# Vivado block design bram_lutwave, xczu28dr-ffvg1517-2-e, Vivado 2021.1
# (continued, part 3 of 5)
current_bd_instance /mix_chan2

create_bd_cell -type ip -vlnv xilinx.com:ip:xlslice:1.0 I0
set_property -dict {CONFIG.DIN_FROM 15 CONFIG.DIN_WIDTH 64 CONFIG.DOUT_WIDTH 16} [get_bd_cells I0]
create_bd_cell -type ip -vlnv xilinx.com:ip:xlslice:1.0 Q0
set_property -dict {CONFIG.DIN_FROM 31 CONFIG.DIN_TO 16 CONFIG.DIN_WIDTH 64 CONFIG.DOUT_WIDTH 16} [get_bd_cells Q0]
create_bd_cell -type ip -vlnv xilinx.com:ip:xlslice:1.0 I1
set_property -dict {CONFIG.DIN_FROM 47 CONFIG.DIN_TO 32 CONFIG.DIN_WIDTH 64 CONFIG.DOUT_WIDTH 16} [get_bd_cells I1]
create_bd_cell -type ip -vlnv xilinx.com:ip:xlslice:1.0 Q1
set_property -dict {CONFIG.DIN_FROM 63 CONFIG.DIN_TO 48 CONFIG.DIN_WIDTH 64 CONFIG.DOUT_WIDTH 16} [get_bd_cells Q1]
create_bd_cell -type ip -vlnv xilinx.com:ip:xlconcat:2.1 xlconcat_0
set_property -dict [list \
  CONFIG.IN0_WIDTH 16 \
  CONFIG.IN1_WIDTH 16 \
  CONFIG.IN2_WIDTH 16 \
  CONFIG.IN3_WIDTH 16 \
  CONFIG.NUM_PORTS 4 \
] [get_bd_cells xlconcat_0]
create_bd_cell -type ip -vlnv xilinx.com:ip:xlslice:1.0 adc_q0
set_property -dict {CONFIG.DIN_FROM 15 CONFIG.DOUT_WIDTH 16} [get_bd_cells adc_q0]
create_bd_cell -type ip -vlnv xilinx.com:ip:xlconstant:1.1 xlconstant_1
create_bd_cell -type ip -vlnv xilinx.com:ip:xlslice:1.0 adc_q1
set_property -dict {CONFIG.DIN_FROM 31 CONFIG.DIN_TO 16 CONFIG.DOUT_WIDTH 16} [get_bd_cells adc_q1]
create_bd_cell -type ip -vlnv xilinx.com:ip:xlconcat:2.1 iin
set_property -dict {CONFIG.IN0_WIDTH 16 CONFIG.IN1_WIDTH 16} [get_bd_cells iin]
create_bd_cell -type ip -vlnv xilinx.com:ip:xlslice:1.0 adc_i0
set_property -dict {CONFIG.DIN_FROM 15 CONFIG.DOUT_WIDTH 16} [get_bd_cells adc_i0]
create_bd_cell -type ip -vlnv xilinx.com:ip:xlslice:1.0 adc_i1
set_property -dict {CONFIG.DIN_FROM 31 CONFIG.DIN_TO 16 CONFIG.DOUT_WIDTH 16} [get_bd_cells adc_i1]
create_bd_cell -type ip -vlnv xilinx.com:ip:xlconcat:2.1 qin
set_property -dict {CONFIG.IN0_WIDTH 16 CONFIG.IN1_WIDTH 16} [get_bd_cells qin]
create_bd_cell -type ip -vlnv User_Company:SysGen:cordic_mix_v1:1.0 cordic_mix_v1_adc
create_bd_cell -type ip -vlnv User_Company:SysGen:cordic_mix_v1:1.0 cordic_mix_v1_dac

# ---- hierarchy /mix_chan3 ----
current_bd_instance /mix_chan3
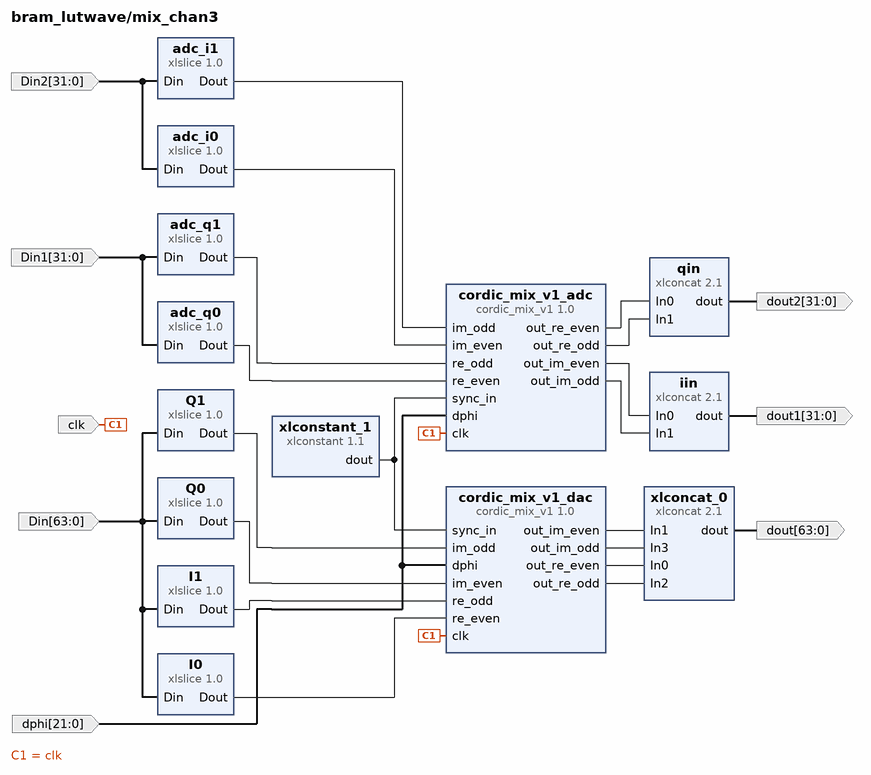
[diagram p36: block diagram inside /mix_chan3]
create_bd_pin -dir I -from 63 -to 0 Din
create_bd_pin -dir I -from 21 -to 0 -type data dphi
create_bd_pin -dir I -type clk clk
create_bd_pin -dir O -from 63 -to 0 dout
create_bd_pin -dir I -from 31 -to 0 Din1
create_bd_pin -dir O -from 31 -to 0 dout1
create_bd_pin -dir I -from 31 -to 0 Din2
create_bd_pin -dir O -from 31 -to 0 dout2

create_bd_cell -type ip -vlnv xilinx.com:ip:xlslice:1.0 I0
set_property -dict {CONFIG.DIN_FROM 15 CONFIG.DIN_WIDTH 64 CONFIG.DOUT_WIDTH 16} [get_bd_cells I0]
create_bd_cell -type ip -vlnv xilinx.com:ip:xlslice:1.0 Q0
set_property -dict {CONFIG.DIN_FROM 31 CONFIG.DIN_TO 16 CONFIG.DIN_WIDTH 64 CONFIG.DOUT_WIDTH 16} [get_bd_cells Q0]
create_bd_cell -type ip -vlnv xilinx.com:ip:xlslice:1.0 I1
set_property -dict {CONFIG.DIN_FROM 47 CONFIG.DIN_TO 32 CONFIG.DIN_WIDTH 64 CONFIG.DOUT_WIDTH 16} [get_bd_cells I1]
create_bd_cell -type ip -vlnv xilinx.com:ip:xlslice:1.0 Q1
set_property -dict {CONFIG.DIN_FROM 63 CONFIG.DIN_TO 48 CONFIG.DIN_WIDTH 64 CONFIG.DOUT_WIDTH 16} [get_bd_cells Q1]
create_bd_cell -type ip -vlnv xilinx.com:ip:xlconcat:2.1 xlconcat_0
set_property -dict [list \
  CONFIG.IN0_WIDTH 16 \
  CONFIG.IN1_WIDTH 16 \
  CONFIG.IN2_WIDTH 16 \
  CONFIG.IN3_WIDTH 16 \
  CONFIG.NUM_PORTS 4 \
] [get_bd_cells xlconcat_0]
create_bd_cell -type ip -vlnv xilinx.com:ip:xlslice:1.0 adc_q0
set_property -dict {CONFIG.DIN_FROM 15 CONFIG.DOUT_WIDTH 16} [get_bd_cells adc_q0]
create_bd_cell -type ip -vlnv xilinx.com:ip:xlconstant:1.1 xlconstant_1
create_bd_cell -type ip -vlnv xilinx.com:ip:xlslice:1.0 adc_q1
set_property -dict {CONFIG.DIN_FROM 31 CONFIG.DIN_TO 16 CONFIG.DOUT_WIDTH 16} [get_bd_cells adc_q1]
create_bd_cell -type ip -vlnv xilinx.com:ip:xlconcat:2.1 iin
set_property -dict {CONFIG.IN0_WIDTH 16 CONFIG.IN1_WIDTH 16} [get_bd_cells iin]
create_bd_cell -type ip -vlnv xilinx.com:ip:xlslice:1.0 adc_i0
set_property -dict {CONFIG.DIN_FROM 15 CONFIG.DOUT_WIDTH 16} [get_bd_cells adc_i0]
create_bd_cell -type ip -vlnv xilinx.com:ip:xlslice:1.0 adc_i1
set_property -dict {CONFIG.DIN_FROM 31 CONFIG.DIN_TO 16 CONFIG.DOUT_WIDTH 16} [get_bd_cells adc_i1]
create_bd_cell -type ip -vlnv xilinx.com:ip:xlconcat:2.1 qin
set_property -dict {CONFIG.IN0_WIDTH 16 CONFIG.IN1_WIDTH 16} [get_bd_cells qin]
create_bd_cell -type ip -vlnv User_Company:SysGen:cordic_mix_v1:1.0 cordic_mix_v1_adc
create_bd_cell -type ip -vlnv User_Company:SysGen:cordic_mix_v1:1.0 cordic_mix_v1_dac

# ---- hierarchy /mix_chan4 ----
current_bd_instance /mix_chan4
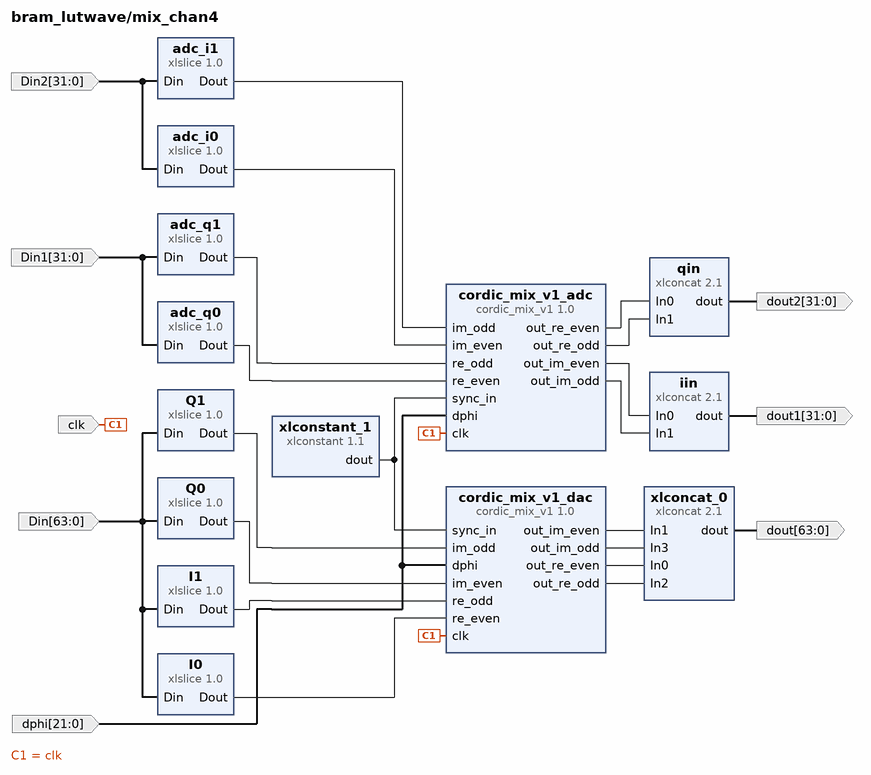
[diagram p37: block diagram inside /mix_chan4]
create_bd_pin -dir I -from 63 -to 0 Din
create_bd_pin -dir I -from 21 -to 0 -type data dphi
create_bd_pin -dir I -type clk clk
create_bd_pin -dir O -from 63 -to 0 dout
create_bd_pin -dir I -from 31 -to 0 Din1
create_bd_pin -dir O -from 31 -to 0 dout1
create_bd_pin -dir I -from 31 -to 0 Din2
create_bd_pin -dir O -from 31 -to 0 dout2

create_bd_cell -type ip -vlnv xilinx.com:ip:xlslice:1.0 I0
set_property -dict {CONFIG.DIN_FROM 15 CONFIG.DIN_WIDTH 64 CONFIG.DOUT_WIDTH 16} [get_bd_cells I0]
create_bd_cell -type ip -vlnv xilinx.com:ip:xlslice:1.0 Q0
set_property -dict {CONFIG.DIN_FROM 31 CONFIG.DIN_TO 16 CONFIG.DIN_WIDTH 64 CONFIG.DOUT_WIDTH 16} [get_bd_cells Q0]
create_bd_cell -type ip -vlnv xilinx.com:ip:xlslice:1.0 I1
set_property -dict {CONFIG.DIN_FROM 47 CONFIG.DIN_TO 32 CONFIG.DIN_WIDTH 64 CONFIG.DOUT_WIDTH 16} [get_bd_cells I1]
create_bd_cell -type ip -vlnv xilinx.com:ip:xlslice:1.0 Q1
set_property -dict {CONFIG.DIN_FROM 63 CONFIG.DIN_TO 48 CONFIG.DIN_WIDTH 64 CONFIG.DOUT_WIDTH 16} [get_bd_cells Q1]
create_bd_cell -type ip -vlnv xilinx.com:ip:xlconcat:2.1 xlconcat_0
set_property -dict [list \
  CONFIG.IN0_WIDTH 16 \
  CONFIG.IN1_WIDTH 16 \
  CONFIG.IN2_WIDTH 16 \
  CONFIG.IN3_WIDTH 16 \
  CONFIG.NUM_PORTS 4 \
] [get_bd_cells xlconcat_0]
create_bd_cell -type ip -vlnv xilinx.com:ip:xlslice:1.0 adc_q0
set_property -dict {CONFIG.DIN_FROM 15 CONFIG.DOUT_WIDTH 16} [get_bd_cells adc_q0]
create_bd_cell -type ip -vlnv xilinx.com:ip:xlconstant:1.1 xlconstant_1
create_bd_cell -type ip -vlnv xilinx.com:ip:xlslice:1.0 adc_q1
set_property -dict {CONFIG.DIN_FROM 31 CONFIG.DIN_TO 16 CONFIG.DOUT_WIDTH 16} [get_bd_cells adc_q1]
create_bd_cell -type ip -vlnv xilinx.com:ip:xlconcat:2.1 iin
set_property -dict {CONFIG.IN0_WIDTH 16 CONFIG.IN1_WIDTH 16} [get_bd_cells iin]
create_bd_cell -type ip -vlnv xilinx.com:ip:xlslice:1.0 adc_i0
set_property -dict {CONFIG.DIN_FROM 15 CONFIG.DOUT_WIDTH 16} [get_bd_cells adc_i0]
create_bd_cell -type ip -vlnv xilinx.com:ip:xlslice:1.0 adc_i1
set_property -dict {CONFIG.DIN_FROM 31 CONFIG.DIN_TO 16 CONFIG.DOUT_WIDTH 16} [get_bd_cells adc_i1]
create_bd_cell -type ip -vlnv xilinx.com:ip:xlconcat:2.1 qin
set_property -dict {CONFIG.IN0_WIDTH 16 CONFIG.IN1_WIDTH 16} [get_bd_cells qin]
create_bd_cell -type ip -vlnv User_Company:SysGen:cordic_mix_v1:1.0 cordic_mix_v1_adc
create_bd_cell -type ip -vlnv User_Company:SysGen:cordic_mix_v1:1.0 cordic_mix_v1_dac

# ---- connections ----

current_bd_instance /chan1
connect_bd_intf_net [get_bd_intf_pins S_AXI2] [get_bd_intf_pins axi_dphi_bram/S_AXI]
connect_bd_intf_net [get_bd_intf_pins axi_dphi_bram/BRAM_PORTA] [get_bd_intf_pins blk_mem_gen_0/BRAM_PORTA]
connect_bd_intf_net [get_bd_intf_pins S_AXI1] [get_bd_intf_pins wide_bram/S_AXI]
connect_bd_intf_net [get_bd_intf_pins S00_AXI] [get_bd_intf_pins dsp_regs_0/S00_AXI]
connect_bd_intf_net [get_bd_intf_pins S_AXI] [get_bd_intf_pins axi_wide_ctrl/S_AXI]
connect_bd_net -net Din_2 [get_bd_pins dsp_regs_0/reg2out] [get_bd_pins accum_sync/Din]
connect_bd_net -net In1_1 [get_bd_pins In1] [get_bd_pins wide_bram/In1] [get_bd_pins i_adc_splitter/Din]
connect_bd_net [get_bd_pins blk_mem_gen_0/doutb] [get_bd_pins even_bin_slice/Din] [get_bd_pins odd_bin_slice/Din]
connect_bd_net -net Q_concat_dout [get_bd_pins fft_concat/dout] [get_bd_pins wide_bram/In2]
connect_bd_net [get_bd_pins accum_concat/dout] [get_bd_pins c_shift_ram_0/D]
connect_bd_net -net axi_gpio_0_gpio2_io_o [get_bd_pins axi_wide_ctrl/gpio2_io_o] [get_bd_pins xlslice_1/Din] [get_bd_pins xlslice_2/Din]
connect_bd_net -net axi_gpio_0_gpio_io_o [get_bd_pins axi_wide_ctrl/gpio_io_o] [get_bd_pins wide_bram/max_count_minus_one_step]
connect_bd_net [get_bd_pins blast_module_v6_cord_0/accum_snap_i0] [get_bd_pins accum_concat/In0]
connect_bd_net [get_bd_pins blast_module_v6_cord_0/accum_snap_i1] [get_bd_pins accum_concat/In2]
connect_bd_net [get_bd_pins blast_module_v6_cord_0/accum_snap_q0] [get_bd_pins accum_concat/In1]
connect_bd_net [get_bd_pins blast_module_v6_cord_0/accum_snap_q1] [get_bd_pins accum_concat/In3]
connect_bd_net [get_bd_pins blast_module_v6_cord_0/accum_snap_sync] [get_bd_pins wide_bram/d4] [get_bd_pins accum_snap_sync]
connect_bd_net [get_bd_pins blast_module_v6_cord_0/ddc_snap_i0q0] [get_bd_pins ddc_concat/In0]
connect_bd_net [get_bd_pins blast_module_v6_cord_0/ddc_snap_i1q1] [get_bd_pins ddc_concat/In1]
connect_bd_net [get_bd_pins blast_module_v6_cord_0/ddc_snap_sync] [get_bd_pins wide_bram/d2]
connect_bd_net [get_bd_pins blast_module_v6_cord_0/fft_snap_i0q0] [get_bd_pins fft_concat/In0]
connect_bd_net [get_bd_pins blast_module_v6_cord_0/fft_snap_i1q1] [get_bd_pins fft_concat/In1]
connect_bd_net [get_bd_pins blast_module_v6_cord_0/fft_snap_sync] [get_bd_pins wide_bram/d1]
connect_bd_net [get_bd_pins c_counter_binary_0/Q] [get_bd_pins blk_mem_gen_0/addrb]
connect_bd_net [get_bd_pins c_shift_ram_0/Q] [get_bd_pins wide_bram/d3] [get_bd_pins Q]
connect_bd_net -net clk_wiz_0_clk_out1 [get_bd_pins s00_axi_aclk] \
  [get_bd_pins dsp_regs_0/s00_axi_aclk] [get_bd_pins wide_bram/s_axi_aclk] [get_bd_pins wide_bram/CLK] \
  [get_bd_pins c_counter_binary_0/CLK] [get_bd_pins blk_mem_gen_0/clkb] [get_bd_pins c_shift_ram_0/CLK] \
  [get_bd_pins axi_dphi_bram/s_axi_aclk] [get_bd_pins blast_module_v6_cord_0/clk]
connect_bd_net -net delay_2_q [get_bd_pins In0] [get_bd_pins wide_bram/In0] [get_bd_pins q_adc_splitter/Din]
connect_bd_net -net dina_1 [get_bd_pins ddc_concat/dout] [get_bd_pins wide_bram/In3]
connect_bd_net [get_bd_pins dsp_regs_0/reg0out] [get_bd_pins fft_shift_slice/Din] [get_bd_pins load_bins_slice/Din]
connect_bd_net [get_bd_pins dsp_regs_0/reg1out] [get_bd_pins bin_num_slice/Din]
connect_bd_net [get_bd_pins dsp_regs_0/reg3out] [get_bd_pins dds_shift_slice/Din]
connect_bd_net [get_bd_pins even_bin_slice/Dout] [get_bd_pins blast_module_v6_cord_0/dphi_even]
connect_bd_net -net gpio1_Dout [get_bd_pins fft_shift_slice/Dout] [get_bd_pins blast_module_v6_cord_0/fft_shift]
connect_bd_net -net gpio1_Dout1 [get_bd_pins load_bins_slice/Dout] [get_bd_pins blast_module_v6_cord_0/load_bins]
connect_bd_net -net i0_Dout [get_bd_pins dds_shift_slice/Dout] [get_bd_pins blast_module_v6_cord_0/dds_shift]
connect_bd_net -net i2_Dout [get_bd_pins bin_num_slice/Dout] [get_bd_pins blast_module_v6_cord_0/bin_num]
connect_bd_net -net i_splitter_i0 [get_bd_pins i_adc_splitter/i0] [get_bd_pins blast_module_v6_cord_0/adc_i0]
connect_bd_net -net i_splitter_i1 [get_bd_pins i_adc_splitter/i1] [get_bd_pins blast_module_v6_cord_0/adc_i1]
connect_bd_net -net module_config_splitter_Dout [get_bd_pins accum_sync/sync_in] \
  [get_bd_pins c_counter_binary_0/CE] [get_bd_pins blk_mem_gen_0/enb] [get_bd_pins blast_module_v6_cord_0/start_dac]
connect_bd_net -net module_config_splitter_accum_len [get_bd_pins accum_sync/accum_len] [get_bd_pins blast_module_v6_cord_0/accum_len]
connect_bd_net -net module_config_splitter_i1 [get_bd_pins accum_sync/accum_rst] [get_bd_pins blast_module_v6_cord_0/accum_reset]
connect_bd_net [get_bd_pins odd_bin_slice/Dout] [get_bd_pins blast_module_v6_cord_0/dphi_odd]
connect_bd_net -net q_splitter_i0 [get_bd_pins q_adc_splitter/i0] [get_bd_pins blast_module_v6_cord_0/adc_q0]
connect_bd_net -net q_splitter_i1 [get_bd_pins q_adc_splitter/i1] [get_bd_pins blast_module_v6_cord_0/adc_q1]
connect_bd_net -net rst_ps8_0_99M1_peripheral_aresetn [get_bd_pins s_axi_aresetn1] \
  [get_bd_pins wide_bram/s_axi_aresetn] [get_bd_pins dsp_regs_0/s00_axi_aresetn] [get_bd_pins axi_dphi_bram/s_axi_aresetn]
connect_bd_net -net rst_ps8_0_99M_peripheral_aresetn [get_bd_pins s_axi_aresetn] [get_bd_pins axi_wide_ctrl/s_axi_aresetn]
connect_bd_net [get_bd_pins xlconstant_5/dout] [get_bd_pins blk_mem_gen_0/web]
connect_bd_net [get_bd_pins xlconstant_6/dout] [get_bd_pins blk_mem_gen_0/rstb]
connect_bd_net [get_bd_pins xlconstant_7/dout] [get_bd_pins blk_mem_gen_0/dinb]
connect_bd_net [get_bd_pins xlslice_1/Dout] [get_bd_pins wide_bram/rising_edge_start]
connect_bd_net [get_bd_pins xlslice_2/Dout] [get_bd_pins wide_bram/sel]
connect_bd_net -net zynq_ultra_ps_e_0_pl_clk0 [get_bd_pins s_axi_aclk] [get_bd_pins axi_wide_ctrl/s_axi_aclk]

current_bd_instance /chan1/q_adc_splitter
connect_bd_net [get_bd_pins i0/Dout] [get_bd_pins i0]
connect_bd_net [get_bd_pins i1/Dout] [get_bd_pins i1]
connect_bd_net -net usp_rf_data_converter_0_m02_axis_tdata [get_bd_pins Din] [get_bd_pins i0/Din] [get_bd_pins i1/Din]

current_bd_instance /chan1/accum_sync
connect_bd_net -net i0_Dout [get_bd_pins accum_len/Dout] [get_bd_pins accum_len]
connect_bd_net -net i1_Dout [get_bd_pins accum_rst/Dout] [get_bd_pins accum_rst]
connect_bd_net -net i2_Dout [get_bd_pins sync_in/Dout] [get_bd_pins sync_in]
connect_bd_net -net usp_rf_data_converter_0_m02_axis_tdata [get_bd_pins Din] \
  [get_bd_pins accum_len/Din] [get_bd_pins accum_rst/Din] [get_bd_pins sync_in/Din]

current_bd_instance /chan1/i_adc_splitter
connect_bd_net [get_bd_pins i0/Dout] [get_bd_pins i0]
connect_bd_net [get_bd_pins i1/Dout] [get_bd_pins i1]
connect_bd_net -net usp_rf_data_converter_0_m02_axis_tdata [get_bd_pins Din] [get_bd_pins i0/Din] [get_bd_pins i1/Din]

current_bd_instance /chan1/wide_bram
connect_bd_intf_net [get_bd_intf_pins axi_bram_ctrl_0/BRAM_PORTA] [get_bd_intf_pins blk_mem_gen_0/BRAM_PORTA]
connect_bd_intf_net [get_bd_intf_pins S_AXI] [get_bd_intf_pins axi_bram_ctrl_0/S_AXI]
connect_bd_net -net In0_1 [get_bd_pins In0] [get_bd_pins adc_concat/In0]
connect_bd_net -net In1_1 [get_bd_pins In1] [get_bd_pins adc_concat/In1]
connect_bd_net -net In2_1 [get_bd_pins In2] [get_bd_pins pfb_concat/In0]
connect_bd_net -net In3_1 [get_bd_pins In3] [get_bd_pins ddc_concat/In0]
connect_bd_net [get_bd_pins axi_bram_mealy_x16_w_0/address] [get_bd_pins blk_mem_gen_0/addrb]
connect_bd_net [get_bd_pins axi_bram_mealy_x16_w_0/we] [get_bd_pins mymux_0/sel]
connect_bd_net [get_bd_pins bool_false_1/dout] [get_bd_pins adc_concat/In2]
connect_bd_net [get_bd_pins bool_false_2/dout] [get_bd_pins pfb_concat/In1]
connect_bd_net [get_bd_pins bool_false_3/dout] [get_bd_pins ddc_concat/In1]
connect_bd_net [get_bd_pins bool_false/dout] [get_bd_pins mymux_0/a_0]
connect_bd_net [get_bd_pins bool_true_1/dout] [get_bd_pins mymux_0/b_1]
connect_bd_net -net d1_1 [get_bd_pins d1] [get_bd_pins mux_4port_1/d1] [get_bd_pins mux_4port_1/d0]
connect_bd_net -net d2_1 [get_bd_pins d2] [get_bd_pins mux_4port_1/d2]
connect_bd_net -net d3_1 [get_bd_pins d3] [get_bd_pins mux_4port_0/d3]
connect_bd_net -net d4_1 [get_bd_pins d4] [get_bd_pins mux_4port_1/d3]
connect_bd_net [get_bd_pins ddc_concat/dout] [get_bd_pins mux_4port_0/d2]
connect_bd_net [get_bd_pins max_count_minus_one_step] [get_bd_pins axi_bram_mealy_x16_w_0/max_count_minus_one_step]
connect_bd_net [get_bd_pins mux_4port_0/q] [get_bd_pins blk_mem_gen_0/dinb]
connect_bd_net [get_bd_pins mux_4port_1/q] [get_bd_pins axi_bram_mealy_x16_w_0/rising_edge_start]
connect_bd_net [get_bd_pins mymux_0/z] [get_bd_pins blk_mem_gen_0/web]
connect_bd_net [get_bd_pins rising_edge_start] [get_bd_pins axi_bram_mealy_x16_w_0/rising_edge_arm]
connect_bd_net -net rst_ps8_0_99M_peripheral_aresetn [get_bd_pins s_axi_aresetn] [get_bd_pins axi_bram_ctrl_0/s_axi_aresetn]
connect_bd_net [get_bd_pins sel] [get_bd_pins mux_4port_0/sel] [get_bd_pins mux_4port_1/sel]
connect_bd_net -net usp_rf_data_converter_0_clk_dac1 [get_bd_pins CLK] \
  [get_bd_pins blk_mem_gen_0/clkb] [get_bd_pins mux_4port_0/clk] [get_bd_pins mymux_0/clk] \
  [get_bd_pins axi_bram_mealy_x16_w_0/clk] [get_bd_pins mux_4port_1/clk]
connect_bd_net -net xlconcat_1_dout [get_bd_pins adc_concat/dout] [get_bd_pins mux_4port_0/d0]
connect_bd_net -net xlconcat_2_dout [get_bd_pins pfb_concat/dout] [get_bd_pins mux_4port_0/d1]
connect_bd_net [get_bd_pins xlconstant_1/dout] [get_bd_pins blk_mem_gen_0/rstb]
connect_bd_net [get_bd_pins xlconstant_2/dout] [get_bd_pins blk_mem_gen_0/enb]
connect_bd_net -net zynq_ultra_ps_e_0_pl_clk0 [get_bd_pins s_axi_aclk] [get_bd_pins axi_bram_ctrl_0/s_axi_aclk]

current_bd_instance /read_machine
connect_bd_net [get_bd_pins fifo_generator_0/dout] [get_bd_pins dout]
connect_bd_net -net Op1_1 [get_bd_pins Op1] [get_bd_pins util_vector_logic_1/Op1]
connect_bd_net [get_bd_pins c_counter_binary_1/Q] [get_bd_pins fifo_generator_0/rd_en]
connect_bd_net [get_bd_pins c_counter_binary_2/THRESH0] [get_bd_pins xlconcat_0/In0]
connect_bd_net [get_bd_pins c_counter_binary_3/Q] [get_bd_pins xlslice_2/Din]
connect_bd_net [get_bd_pins c_counter_binary_4/Q] [get_bd_pins xlconcat_1/In1]
connect_bd_net -net clk_wiz_0_clk_out1 [get_bd_pins rd_clk] [get_bd_pins fifo_generator_0/rd_clk] [get_bd_pins c_counter_binary_1/CLK]
connect_bd_net -net ddr4_0_c0_ddr4_s_axi_rdata [get_bd_pins din] [get_bd_pins fifo_generator_0/din]
connect_bd_net -net eth_wrap_tx_clk125MHz [get_bd_pins wr_clk] \
  [get_bd_pins fifo_generator_0/wr_clk] [get_bd_pins c_counter_binary_2/CLK] [get_bd_pins c_counter_binary_3/CLK] \
  [get_bd_pins c_counter_binary_4/CLK] [get_bd_pins rise_edge_0/clk]
connect_bd_net [get_bd_pins fifo_generator_0/prog_full] [get_bd_pins util_vector_logic_0/Op1]
connect_bd_net [get_bd_pins rise_edge_0/q] [get_bd_pins q]
connect_bd_net [get_bd_pins util_reduced_logic_0/Res] \
  [get_bd_pins c_counter_binary_3/CE] [get_bd_pins c_counter_binary_4/CE] [get_bd_pins rise_edge_0/a]
connect_bd_net [get_bd_pins util_vector_logic_0/Res] [get_bd_pins xlconcat_0/In2]
connect_bd_net [get_bd_pins util_vector_logic_1/Res] [get_bd_pins c_counter_binary_2/CE] [get_bd_pins xlconcat_0/In1]
connect_bd_net [get_bd_pins wr_en] [get_bd_pins fifo_generator_0/wr_en]
connect_bd_net [get_bd_pins xlconcat_0/dout] [get_bd_pins util_reduced_logic_0/Op1]
connect_bd_net [get_bd_pins xlconcat_1/dout] [get_bd_pins dout1]
connect_bd_net [get_bd_pins xlconstant_2/dout] [get_bd_pins fifo_generator_0/srst]
connect_bd_net [get_bd_pins xlconstant_5/dout] [get_bd_pins xlconcat_1/In0]
connect_bd_net [get_bd_pins xlslice_2/Dout] [get_bd_pins xlconcat_1/In2]

current_bd_instance /refresh_machine
connect_bd_net [get_bd_pins CE] [get_bd_pins c_counter_binary_0/CE]
connect_bd_net [get_bd_pins clk] [get_bd_pins c_counter_binary_0/CLK] [get_bd_pins d_flip_0/clk] [get_bd_pins d_flip_1/clk]
connect_bd_net [get_bd_pins c_counter_binary_0/THRESH0] \
  [get_bd_pins d_flip_0/data_in] [get_bd_pins d_flip_0/en] [get_bd_pins d_flip_1/data_in] [get_bd_pins d_flip_1/en] \
  [get_bd_pins THRESH0]
connect_bd_net [get_bd_pins d_flip_0/data_out] [get_bd_pins util_vector_logic_0/Op1]
connect_bd_net [get_bd_pins d_flip_1/data_out] [get_bd_pins util_vector_logic_0/Op2]
connect_bd_net -net rst1_1 [get_bd_pins rst1] [get_bd_pins d_flip_1/rst]
connect_bd_net [get_bd_pins rst] [get_bd_pins d_flip_0/rst]
connect_bd_net [get_bd_pins util_vector_logic_0/Res] [get_bd_pins Res]

current_bd_instance /chan1ts
connect_bd_net [get_bd_pins bot65/Dout] [get_bd_pins mux_0/a_0]
connect_bd_net [get_bd_pins c_counter_binary_0/Q] [get_bd_pins mux_0/sel]
connect_bd_net -net clk_wiz_0_clk_out1 [get_bd_pins CLK] [get_bd_pins c_counter_binary_0/CLK]
connect_bd_net [get_bd_pins mux_0/z] [get_bd_pins z]
connect_bd_net -net slice_chan4_Dout [get_bd_pins Din] [get_bd_pins bot65/Din] [get_bd_pins top64/Din]
connect_bd_net [get_bd_pins top64/Dout] [get_bd_pins mux_0/b_1]

current_bd_instance /chan2
connect_bd_intf_net [get_bd_intf_pins S_AXI2] [get_bd_intf_pins axi_dphi_bram/S_AXI]
connect_bd_intf_net [get_bd_intf_pins axi_dphi_bram/BRAM_PORTA] [get_bd_intf_pins blk_mem_gen_0/BRAM_PORTA]
connect_bd_intf_net [get_bd_intf_pins S_AXI1] [get_bd_intf_pins wide_bram/S_AXI]
connect_bd_intf_net [get_bd_intf_pins S00_AXI] [get_bd_intf_pins dsp_regs_0/S00_AXI]
connect_bd_intf_net [get_bd_intf_pins S_AXI] [get_bd_intf_pins axi_wide_ctrl/S_AXI]
connect_bd_net -net Din_2 [get_bd_pins dsp_regs_0/reg2out] [get_bd_pins accum_sync/Din]
connect_bd_net -net In1_1 [get_bd_pins In1] [get_bd_pins wide_bram/In1] [get_bd_pins i_adc_splitter/Din]
connect_bd_net [get_bd_pins blk_mem_gen_0/doutb] [get_bd_pins even_bin_slice/Din] [get_bd_pins odd_bin_slice/Din]
connect_bd_net -net Q_concat_dout [get_bd_pins fft_concat/dout] [get_bd_pins wide_bram/In2]
connect_bd_net [get_bd_pins accum_concat/dout] [get_bd_pins c_shift_ram_0/D]
connect_bd_net -net axi_gpio_0_gpio2_io_o [get_bd_pins axi_wide_ctrl/gpio2_io_o] [get_bd_pins xlslice_1/Din] [get_bd_pins xlslice_2/Din]
connect_bd_net -net axi_gpio_0_gpio_io_o [get_bd_pins axi_wide_ctrl/gpio_io_o] [get_bd_pins wide_bram/max_count_minus_one_step]
connect_bd_net [get_bd_pins blast_module_v6_cord_0/accum_snap_i0] [get_bd_pins accum_concat/In0]
connect_bd_net [get_bd_pins blast_module_v6_cord_0/accum_snap_i1] [get_bd_pins accum_concat/In2]
connect_bd_net [get_bd_pins blast_module_v6_cord_0/accum_snap_q0] [get_bd_pins accum_concat/In1]
connect_bd_net [get_bd_pins blast_module_v6_cord_0/accum_snap_q1] [get_bd_pins accum_concat/In3]
connect_bd_net [get_bd_pins blast_module_v6_cord_0/accum_snap_sync] [get_bd_pins wide_bram/d4] [get_bd_pins accum_snap_sync]
connect_bd_net [get_bd_pins blast_module_v6_cord_0/ddc_snap_i0q0] [get_bd_pins ddc_concat/In0]
connect_bd_net [get_bd_pins blast_module_v6_cord_0/ddc_snap_i1q1] [get_bd_pins ddc_concat/In1]
connect_bd_net [get_bd_pins blast_module_v6_cord_0/ddc_snap_sync] [get_bd_pins wide_bram/d2]
connect_bd_net [get_bd_pins blast_module_v6_cord_0/fft_snap_i0q0] [get_bd_pins fft_concat/In0]
connect_bd_net [get_bd_pins blast_module_v6_cord_0/fft_snap_i1q1] [get_bd_pins fft_concat/In1]
connect_bd_net [get_bd_pins blast_module_v6_cord_0/fft_snap_sync] [get_bd_pins wide_bram/d1]
connect_bd_net [get_bd_pins c_counter_binary_0/Q] [get_bd_pins blk_mem_gen_0/addrb]
connect_bd_net [get_bd_pins c_shift_ram_0/Q] [get_bd_pins wide_bram/d3] [get_bd_pins Q]
connect_bd_net -net clk_wiz_0_clk_out1 [get_bd_pins s00_axi_aclk] \
  [get_bd_pins dsp_regs_0/s00_axi_aclk] [get_bd_pins wide_bram/s_axi_aclk] [get_bd_pins wide_bram/CLK] \
  [get_bd_pins c_counter_binary_0/CLK] [get_bd_pins blk_mem_gen_0/clkb] [get_bd_pins c_shift_ram_0/CLK] \
  [get_bd_pins axi_dphi_bram/s_axi_aclk] [get_bd_pins blast_module_v6_cord_0/clk]
connect_bd_net -net delay_2_q [get_bd_pins In0] [get_bd_pins wide_bram/In0] [get_bd_pins q_adc_splitter/Din]
connect_bd_net -net dina_1 [get_bd_pins ddc_concat/dout] [get_bd_pins wide_bram/In3]
connect_bd_net [get_bd_pins dsp_regs_0/reg0out] [get_bd_pins fft_shift_slice/Din] [get_bd_pins load_bins_slice/Din]
connect_bd_net [get_bd_pins dsp_regs_0/reg1out] [get_bd_pins bin_num_slice/Din]
connect_bd_net [get_bd_pins dsp_regs_0/reg3out] [get_bd_pins dds_shift_slice/Din]
connect_bd_net [get_bd_pins even_bin_slice/Dout] [get_bd_pins blast_module_v6_cord_0/dphi_even]
connect_bd_net -net gpio1_Dout [get_bd_pins fft_shift_slice/Dout] [get_bd_pins blast_module_v6_cord_0/fft_shift]
connect_bd_net -net gpio1_Dout1 [get_bd_pins load_bins_slice/Dout] [get_bd_pins blast_module_v6_cord_0/load_bins]
connect_bd_net -net i0_Dout [get_bd_pins dds_shift_slice/Dout] [get_bd_pins blast_module_v6_cord_0/dds_shift]
connect_bd_net -net i2_Dout [get_bd_pins bin_num_slice/Dout] [get_bd_pins blast_module_v6_cord_0/bin_num]
connect_bd_net -net i_splitter_i0 [get_bd_pins i_adc_splitter/i0] [get_bd_pins blast_module_v6_cord_0/adc_i0]
connect_bd_net -net i_splitter_i1 [get_bd_pins i_adc_splitter/i1] [get_bd_pins blast_module_v6_cord_0/adc_i1]
connect_bd_net -net module_config_splitter_Dout [get_bd_pins accum_sync/sync_in] \
  [get_bd_pins c_counter_binary_0/CE] [get_bd_pins blk_mem_gen_0/enb] [get_bd_pins blast_module_v6_cord_0/start_dac]
connect_bd_net -net module_config_splitter_accum_len [get_bd_pins accum_sync/accum_len] [get_bd_pins blast_module_v6_cord_0/accum_len]
connect_bd_net -net module_config_splitter_i1 [get_bd_pins accum_sync/accum_rst] [get_bd_pins blast_module_v6_cord_0/accum_reset]
connect_bd_net [get_bd_pins odd_bin_slice/Dout] [get_bd_pins blast_module_v6_cord_0/dphi_odd]
connect_bd_net -net q_splitter_i0 [get_bd_pins q_adc_splitter/i0] [get_bd_pins blast_module_v6_cord_0/adc_q0]
connect_bd_net -net q_splitter_i1 [get_bd_pins q_adc_splitter/i1] [get_bd_pins blast_module_v6_cord_0/adc_q1]
connect_bd_net -net s_axi_aresetn1_1 [get_bd_pins s_axi_aresetn1] \
  [get_bd_pins wide_bram/s_axi_aresetn] [get_bd_pins dsp_regs_0/s00_axi_aresetn] [get_bd_pins axi_dphi_bram/s_axi_aresetn]
connect_bd_net [get_bd_pins s_axi_aresetn] [get_bd_pins axi_wide_ctrl/s_axi_aresetn]
connect_bd_net [get_bd_pins xlconstant_5/dout] [get_bd_pins blk_mem_gen_0/web]
connect_bd_net [get_bd_pins xlconstant_6/dout] [get_bd_pins blk_mem_gen_0/rstb]
connect_bd_net [get_bd_pins xlconstant_7/dout] [get_bd_pins blk_mem_gen_0/dinb]
connect_bd_net [get_bd_pins xlslice_1/Dout] [get_bd_pins wide_bram/rising_edge_start]
connect_bd_net [get_bd_pins xlslice_2/Dout] [get_bd_pins wide_bram/sel]
connect_bd_net -net zynq_ultra_ps_e_0_pl_clk0 [get_bd_pins s_axi_aclk] [get_bd_pins axi_wide_ctrl/s_axi_aclk]

current_bd_instance /chan2/q_adc_splitter
connect_bd_net [get_bd_pins i0/Dout] [get_bd_pins i0]
connect_bd_net [get_bd_pins i1/Dout] [get_bd_pins i1]
connect_bd_net -net usp_rf_data_converter_0_m02_axis_tdata [get_bd_pins Din] [get_bd_pins i0/Din] [get_bd_pins i1/Din]

current_bd_instance /chan2/accum_sync
connect_bd_net -net i0_Dout [get_bd_pins accum_len/Dout] [get_bd_pins accum_len]
connect_bd_net -net i1_Dout [get_bd_pins accum_rst/Dout] [get_bd_pins accum_rst]
connect_bd_net -net i2_Dout [get_bd_pins sync_in/Dout] [get_bd_pins sync_in]
connect_bd_net -net usp_rf_data_converter_0_m02_axis_tdata [get_bd_pins Din] \
  [get_bd_pins accum_len/Din] [get_bd_pins accum_rst/Din] [get_bd_pins sync_in/Din]

current_bd_instance /chan2/i_adc_splitter
connect_bd_net [get_bd_pins i0/Dout] [get_bd_pins i0]
connect_bd_net [get_bd_pins i1/Dout] [get_bd_pins i1]
connect_bd_net -net usp_rf_data_converter_0_m02_axis_tdata [get_bd_pins Din] [get_bd_pins i0/Din] [get_bd_pins i1/Din]

current_bd_instance /chan2/wide_bram
connect_bd_intf_net [get_bd_intf_pins axi_bram_ctrl_0/BRAM_PORTA] [get_bd_intf_pins blk_mem_gen_0/BRAM_PORTA]
connect_bd_intf_net [get_bd_intf_pins S_AXI] [get_bd_intf_pins axi_bram_ctrl_0/S_AXI]
connect_bd_net -net In0_1 [get_bd_pins In0] [get_bd_pins adc_concat/In0]
connect_bd_net -net In1_1 [get_bd_pins In1] [get_bd_pins adc_concat/In1]
connect_bd_net -net In2_1 [get_bd_pins In2] [get_bd_pins pfb_concat/In0]
connect_bd_net -net In3_1 [get_bd_pins In3] [get_bd_pins ddc_concat/In0]
connect_bd_net [get_bd_pins axi_bram_mealy_x16_w_0/address] [get_bd_pins blk_mem_gen_0/addrb]
connect_bd_net [get_bd_pins axi_bram_mealy_x16_w_0/we] [get_bd_pins mymux_0/sel]
connect_bd_net [get_bd_pins bool_false_1/dout] [get_bd_pins adc_concat/In2]
connect_bd_net [get_bd_pins bool_false_2/dout] [get_bd_pins pfb_concat/In1]
connect_bd_net [get_bd_pins bool_false_3/dout] [get_bd_pins ddc_concat/In1]
connect_bd_net [get_bd_pins bool_false/dout] [get_bd_pins mymux_0/a_0]
connect_bd_net [get_bd_pins bool_true_1/dout] [get_bd_pins mymux_0/b_1]
connect_bd_net -net d1_1 [get_bd_pins d1] [get_bd_pins mux_4port_1/d1] [get_bd_pins mux_4port_1/d0]
connect_bd_net -net d2_1 [get_bd_pins d2] [get_bd_pins mux_4port_1/d2]
connect_bd_net -net d3_1 [get_bd_pins d3] [get_bd_pins mux_4port_0/d3]
connect_bd_net -net d4_1 [get_bd_pins d4] [get_bd_pins mux_4port_1/d3]
connect_bd_net [get_bd_pins ddc_concat/dout] [get_bd_pins mux_4port_0/d2]
connect_bd_net [get_bd_pins max_count_minus_one_step] [get_bd_pins axi_bram_mealy_x16_w_0/max_count_minus_one_step]
connect_bd_net [get_bd_pins mux_4port_0/q] [get_bd_pins blk_mem_gen_0/dinb]
connect_bd_net [get_bd_pins mux_4port_1/q] [get_bd_pins axi_bram_mealy_x16_w_0/rising_edge_start]
connect_bd_net [get_bd_pins mymux_0/z] [get_bd_pins blk_mem_gen_0/web]
connect_bd_net [get_bd_pins rising_edge_start] [get_bd_pins axi_bram_mealy_x16_w_0/rising_edge_arm]
connect_bd_net -net rst_ps8_0_99M_peripheral_aresetn [get_bd_pins s_axi_aresetn] [get_bd_pins axi_bram_ctrl_0/s_axi_aresetn]
connect_bd_net [get_bd_pins sel] [get_bd_pins mux_4port_0/sel] [get_bd_pins mux_4port_1/sel]
connect_bd_net -net usp_rf_data_converter_0_clk_dac1 [get_bd_pins CLK] \
  [get_bd_pins blk_mem_gen_0/clkb] [get_bd_pins mux_4port_0/clk] [get_bd_pins mymux_0/clk] \
  [get_bd_pins axi_bram_mealy_x16_w_0/clk] [get_bd_pins mux_4port_1/clk]
connect_bd_net -net xlconcat_1_dout [get_bd_pins adc_concat/dout] [get_bd_pins mux_4port_0/d0]
connect_bd_net -net xlconcat_2_dout [get_bd_pins pfb_concat/dout] [get_bd_pins mux_4port_0/d1]
connect_bd_net [get_bd_pins xlconstant_1/dout] [get_bd_pins blk_mem_gen_0/rstb]
connect_bd_net [get_bd_pins xlconstant_2/dout] [get_bd_pins blk_mem_gen_0/enb]
connect_bd_net -net zynq_ultra_ps_e_0_pl_clk0 [get_bd_pins s_axi_aclk] [get_bd_pins axi_bram_ctrl_0/s_axi_aclk]

current_bd_instance /chan2ts
connect_bd_net [get_bd_pins bot65/Dout] [get_bd_pins mux_0/a_0]
connect_bd_net [get_bd_pins c_counter_binary_0/Q] [get_bd_pins mux_0/sel]
connect_bd_net -net clk_wiz_0_clk_out1 [get_bd_pins CLK] [get_bd_pins c_counter_binary_0/CLK]
connect_bd_net [get_bd_pins mux_0/z] [get_bd_pins z]
connect_bd_net -net slice_chan4_Dout [get_bd_pins Din] [get_bd_pins bot65/Din] [get_bd_pins top64/Din]
connect_bd_net [get_bd_pins top64/Dout] [get_bd_pins mux_0/b_1]

current_bd_instance /chan3ts
connect_bd_net [get_bd_pins bot65/Dout] [get_bd_pins mux_0/a_0]
connect_bd_net [get_bd_pins c_counter_binary_0/Q] [get_bd_pins mux_0/sel]
connect_bd_net -net clk_wiz_0_clk_out1 [get_bd_pins CLK] [get_bd_pins c_counter_binary_0/CLK]
connect_bd_net [get_bd_pins mux_0/z] [get_bd_pins z]
connect_bd_net -net slice_chan4_Dout [get_bd_pins Din] [get_bd_pins bot65/Din] [get_bd_pins top64/Din]
connect_bd_net [get_bd_pins top64/Dout] [get_bd_pins mux_0/b_1]

current_bd_instance /chan4ts
connect_bd_net [get_bd_pins bot65/Dout] [get_bd_pins mux_0/a_0]
connect_bd_net [get_bd_pins c_counter_binary_0/Q] [get_bd_pins mux_0/sel]
connect_bd_net -net clk_wiz_0_clk_out1 [get_bd_pins CLK] [get_bd_pins c_counter_binary_0/CLK]
connect_bd_net [get_bd_pins mux_0/z] [get_bd_pins z]
connect_bd_net -net slice_chan4_Dout [get_bd_pins Din] [get_bd_pins bot65/Din] [get_bd_pins top64/Din]
connect_bd_net [get_bd_pins top64/Dout] [get_bd_pins mux_0/b_1]

current_bd_instance /chan3
connect_bd_intf_net [get_bd_intf_pins S_AXI2] [get_bd_intf_pins axi_dphi_bram/S_AXI]
connect_bd_intf_net [get_bd_intf_pins axi_dphi_bram/BRAM_PORTA] [get_bd_intf_pins blk_mem_gen_0/BRAM_PORTA]
connect_bd_intf_net [get_bd_intf_pins S_AXI1] [get_bd_intf_pins wide_bram/S_AXI]
connect_bd_intf_net [get_bd_intf_pins S00_AXI] [get_bd_intf_pins dsp_regs_0/S00_AXI]
connect_bd_intf_net [get_bd_intf_pins S_AXI] [get_bd_intf_pins axi_wide_ctrl/S_AXI]
connect_bd_net -net Din_2 [get_bd_pins dsp_regs_0/reg2out] [get_bd_pins accum_sync/Din]
connect_bd_net -net In1_1 [get_bd_pins In1] [get_bd_pins wide_bram/In1] [get_bd_pins i_adc_splitter/Din]
connect_bd_net [get_bd_pins blk_mem_gen_0/doutb] [get_bd_pins even_bin_slice/Din] [get_bd_pins odd_bin_slice/Din]
connect_bd_net -net Q_concat_dout [get_bd_pins fft_concat/dout] [get_bd_pins wide_bram/In2]
connect_bd_net [get_bd_pins accum_concat/dout] [get_bd_pins c_shift_ram_0/D]
connect_bd_net -net axi_gpio_0_gpio2_io_o [get_bd_pins axi_wide_ctrl/gpio2_io_o] [get_bd_pins xlslice_1/Din] [get_bd_pins xlslice_2/Din]
connect_bd_net -net axi_gpio_0_gpio_io_o [get_bd_pins axi_wide_ctrl/gpio_io_o] [get_bd_pins wide_bram/max_count_minus_one_step]
connect_bd_net [get_bd_pins blast_module_v6_cord_0/accum_snap_i0] [get_bd_pins accum_concat/In0]
connect_bd_net [get_bd_pins blast_module_v6_cord_0/accum_snap_i1] [get_bd_pins accum_concat/In2]
connect_bd_net [get_bd_pins blast_module_v6_cord_0/accum_snap_q0] [get_bd_pins accum_concat/In1]
connect_bd_net [get_bd_pins blast_module_v6_cord_0/accum_snap_q1] [get_bd_pins accum_concat/In3]
connect_bd_net [get_bd_pins blast_module_v6_cord_0/accum_snap_sync] [get_bd_pins wide_bram/d4] [get_bd_pins accum_snap_sync]
connect_bd_net [get_bd_pins blast_module_v6_cord_0/ddc_snap_i0q0] [get_bd_pins ddc_concat/In0]
connect_bd_net [get_bd_pins blast_module_v6_cord_0/ddc_snap_i1q1] [get_bd_pins ddc_concat/In1]
connect_bd_net [get_bd_pins blast_module_v6_cord_0/ddc_snap_sync] [get_bd_pins wide_bram/d2]
connect_bd_net [get_bd_pins blast_module_v6_cord_0/fft_snap_i0q0] [get_bd_pins fft_concat/In0]
connect_bd_net [get_bd_pins blast_module_v6_cord_0/fft_snap_i1q1] [get_bd_pins fft_concat/In1]
connect_bd_net [get_bd_pins blast_module_v6_cord_0/fft_snap_sync] [get_bd_pins wide_bram/d1]
connect_bd_net [get_bd_pins c_counter_binary_0/Q] [get_bd_pins blk_mem_gen_0/addrb]
connect_bd_net [get_bd_pins c_shift_ram_0/Q] [get_bd_pins wide_bram/d3] [get_bd_pins Q]
connect_bd_net -net clk_wiz_0_clk_out1 [get_bd_pins s00_axi_aclk] \
  [get_bd_pins dsp_regs_0/s00_axi_aclk] [get_bd_pins wide_bram/s_axi_aclk] [get_bd_pins wide_bram/CLK] \
  [get_bd_pins c_counter_binary_0/CLK] [get_bd_pins blk_mem_gen_0/clkb] [get_bd_pins c_shift_ram_0/CLK] \
  [get_bd_pins axi_dphi_bram/s_axi_aclk] [get_bd_pins blast_module_v6_cord_0/clk]
connect_bd_net -net delay_2_q [get_bd_pins In0] [get_bd_pins wide_bram/In0] [get_bd_pins q_adc_splitter/Din]
connect_bd_net -net dina_1 [get_bd_pins ddc_concat/dout] [get_bd_pins wide_bram/In3]
connect_bd_net [get_bd_pins dsp_regs_0/reg0out] [get_bd_pins fft_shift_slice/Din] [get_bd_pins load_bins_slice/Din]
connect_bd_net [get_bd_pins dsp_regs_0/reg1out] [get_bd_pins bin_num_slice/Din]
connect_bd_net [get_bd_pins dsp_regs_0/reg3out] [get_bd_pins dds_shift_slice/Din]
connect_bd_net [get_bd_pins even_bin_slice/Dout] [get_bd_pins blast_module_v6_cord_0/dphi_even]
connect_bd_net -net gpio1_Dout [get_bd_pins fft_shift_slice/Dout] [get_bd_pins blast_module_v6_cord_0/fft_shift]
connect_bd_net -net gpio1_Dout1 [get_bd_pins load_bins_slice/Dout] [get_bd_pins blast_module_v6_cord_0/load_bins]
connect_bd_net -net i0_Dout [get_bd_pins dds_shift_slice/Dout] [get_bd_pins blast_module_v6_cord_0/dds_shift]
connect_bd_net -net i2_Dout [get_bd_pins bin_num_slice/Dout] [get_bd_pins blast_module_v6_cord_0/bin_num]
connect_bd_net -net i_splitter_i0 [get_bd_pins i_adc_splitter/i0] [get_bd_pins blast_module_v6_cord_0/adc_i0]
connect_bd_net -net i_splitter_i1 [get_bd_pins i_adc_splitter/i1] [get_bd_pins blast_module_v6_cord_0/adc_i1]
connect_bd_net -net module_config_splitter_Dout [get_bd_pins accum_sync/sync_in] \
  [get_bd_pins c_counter_binary_0/CE] [get_bd_pins blk_mem_gen_0/enb] [get_bd_pins blast_module_v6_cord_0/start_dac]
connect_bd_net -net module_config_splitter_accum_len [get_bd_pins accum_sync/accum_len] [get_bd_pins blast_module_v6_cord_0/accum_len]
connect_bd_net -net module_config_splitter_i1 [get_bd_pins accum_sync/accum_rst] [get_bd_pins blast_module_v6_cord_0/accum_reset]
connect_bd_net [get_bd_pins odd_bin_slice/Dout] [get_bd_pins blast_module_v6_cord_0/dphi_odd]
connect_bd_net -net q_splitter_i0 [get_bd_pins q_adc_splitter/i0] [get_bd_pins blast_module_v6_cord_0/adc_q0]
connect_bd_net -net q_splitter_i1 [get_bd_pins q_adc_splitter/i1] [get_bd_pins blast_module_v6_cord_0/adc_q1]
connect_bd_net -net s_axi_aresetn1_1 [get_bd_pins s_axi_aresetn1] \
  [get_bd_pins wide_bram/s_axi_aresetn] [get_bd_pins dsp_regs_0/s00_axi_aresetn] [get_bd_pins axi_dphi_bram/s_axi_aresetn]
connect_bd_net [get_bd_pins s_axi_aresetn] [get_bd_pins axi_wide_ctrl/s_axi_aresetn]
connect_bd_net [get_bd_pins xlconstant_5/dout] [get_bd_pins blk_mem_gen_0/web]
connect_bd_net [get_bd_pins xlconstant_6/dout] [get_bd_pins blk_mem_gen_0/rstb]
connect_bd_net [get_bd_pins xlconstant_7/dout] [get_bd_pins blk_mem_gen_0/dinb]
connect_bd_net [get_bd_pins xlslice_1/Dout] [get_bd_pins wide_bram/rising_edge_start]
connect_bd_net [get_bd_pins xlslice_2/Dout] [get_bd_pins wide_bram/sel]
connect_bd_net -net zynq_ultra_ps_e_0_pl_clk0 [get_bd_pins s_axi_aclk] [get_bd_pins axi_wide_ctrl/s_axi_aclk]

current_bd_instance /chan3/q_adc_splitter
connect_bd_net [get_bd_pins i0/Dout] [get_bd_pins i0]
connect_bd_net [get_bd_pins i1/Dout] [get_bd_pins i1]
connect_bd_net -net usp_rf_data_converter_0_m02_axis_tdata [get_bd_pins Din] [get_bd_pins i0/Din] [get_bd_pins i1/Din]

current_bd_instance /chan3/accum_sync
connect_bd_net -net i0_Dout [get_bd_pins accum_len/Dout] [get_bd_pins accum_len]
connect_bd_net -net i1_Dout [get_bd_pins accum_rst/Dout] [get_bd_pins accum_rst]
connect_bd_net -net i2_Dout [get_bd_pins sync_in/Dout] [get_bd_pins sync_in]
connect_bd_net -net usp_rf_data_converter_0_m02_axis_tdata [get_bd_pins Din] \
  [get_bd_pins accum_len/Din] [get_bd_pins accum_rst/Din] [get_bd_pins sync_in/Din]

current_bd_instance /chan3/i_adc_splitter
connect_bd_net [get_bd_pins i0/Dout] [get_bd_pins i0]
connect_bd_net [get_bd_pins i1/Dout] [get_bd_pins i1]
connect_bd_net -net usp_rf_data_converter_0_m02_axis_tdata [get_bd_pins Din] [get_bd_pins i0/Din] [get_bd_pins i1/Din]

current_bd_instance /chan3/wide_bram
connect_bd_intf_net [get_bd_intf_pins axi_bram_ctrl_0/BRAM_PORTA] [get_bd_intf_pins blk_mem_gen_0/BRAM_PORTA]
connect_bd_intf_net [get_bd_intf_pins S_AXI] [get_bd_intf_pins axi_bram_ctrl_0/S_AXI]
connect_bd_net -net In0_1 [get_bd_pins In0] [get_bd_pins adc_concat/In0]
connect_bd_net -net In1_1 [get_bd_pins In1] [get_bd_pins adc_concat/In1]
connect_bd_net -net In2_1 [get_bd_pins In2] [get_bd_pins pfb_concat/In0]
connect_bd_net -net In3_1 [get_bd_pins In3] [get_bd_pins ddc_concat/In0]
connect_bd_net [get_bd_pins axi_bram_mealy_x16_w_0/address] [get_bd_pins blk_mem_gen_0/addrb]
connect_bd_net [get_bd_pins axi_bram_mealy_x16_w_0/we] [get_bd_pins mymux_0/sel]
connect_bd_net [get_bd_pins bool_false_1/dout] [get_bd_pins adc_concat/In2]
connect_bd_net [get_bd_pins bool_false_2/dout] [get_bd_pins pfb_concat/In1]
connect_bd_net [get_bd_pins bool_false_3/dout] [get_bd_pins ddc_concat/In1]
connect_bd_net [get_bd_pins bool_false/dout] [get_bd_pins mymux_0/a_0]
connect_bd_net [get_bd_pins bool_true_1/dout] [get_bd_pins mymux_0/b_1]
connect_bd_net -net d1_1 [get_bd_pins d1] [get_bd_pins mux_4port_1/d1] [get_bd_pins mux_4port_1/d0]
connect_bd_net -net d2_1 [get_bd_pins d2] [get_bd_pins mux_4port_1/d2]
connect_bd_net -net d3_1 [get_bd_pins d3] [get_bd_pins mux_4port_0/d3]
connect_bd_net -net d4_1 [get_bd_pins d4] [get_bd_pins mux_4port_1/d3]
connect_bd_net [get_bd_pins ddc_concat/dout] [get_bd_pins mux_4port_0/d2]
connect_bd_net [get_bd_pins max_count_minus_one_step] [get_bd_pins axi_bram_mealy_x16_w_0/max_count_minus_one_step]
connect_bd_net [get_bd_pins mux_4port_0/q] [get_bd_pins blk_mem_gen_0/dinb]
connect_bd_net [get_bd_pins mux_4port_1/q] [get_bd_pins axi_bram_mealy_x16_w_0/rising_edge_start]
connect_bd_net [get_bd_pins mymux_0/z] [get_bd_pins blk_mem_gen_0/web]
connect_bd_net [get_bd_pins rising_edge_start] [get_bd_pins axi_bram_mealy_x16_w_0/rising_edge_arm]
connect_bd_net -net rst_ps8_0_99M_peripheral_aresetn [get_bd_pins s_axi_aresetn] [get_bd_pins axi_bram_ctrl_0/s_axi_aresetn]
connect_bd_net [get_bd_pins sel] [get_bd_pins mux_4port_0/sel] [get_bd_pins mux_4port_1/sel]
connect_bd_net -net usp_rf_data_converter_0_clk_dac1 [get_bd_pins CLK] \
  [get_bd_pins blk_mem_gen_0/clkb] [get_bd_pins mux_4port_0/clk] [get_bd_pins mymux_0/clk] \
  [get_bd_pins axi_bram_mealy_x16_w_0/clk] [get_bd_pins mux_4port_1/clk]
connect_bd_net -net xlconcat_1_dout [get_bd_pins adc_concat/dout] [get_bd_pins mux_4port_0/d0]
connect_bd_net -net xlconcat_2_dout [get_bd_pins pfb_concat/dout] [get_bd_pins mux_4port_0/d1]
connect_bd_net [get_bd_pins xlconstant_1/dout] [get_bd_pins blk_mem_gen_0/rstb]
connect_bd_net [get_bd_pins xlconstant_2/dout] [get_bd_pins blk_mem_gen_0/enb]
connect_bd_net -net zynq_ultra_ps_e_0_pl_clk0 [get_bd_pins s_axi_aclk] [get_bd_pins axi_bram_ctrl_0/s_axi_aclk]

current_bd_instance /chan4
connect_bd_intf_net [get_bd_intf_pins S_AXI2] [get_bd_intf_pins axi_dphi_bram/S_AXI]
connect_bd_intf_net [get_bd_intf_pins axi_dphi_bram/BRAM_PORTA] [get_bd_intf_pins blk_mem_gen_0/BRAM_PORTA]
connect_bd_intf_net [get_bd_intf_pins S_AXI1] [get_bd_intf_pins wide_bram/S_AXI]
connect_bd_intf_net [get_bd_intf_pins S00_AXI] [get_bd_intf_pins dsp_regs_0/S00_AXI]
connect_bd_intf_net [get_bd_intf_pins S_AXI] [get_bd_intf_pins axi_wide_ctrl/S_AXI]
connect_bd_net -net Din_2 [get_bd_pins dsp_regs_0/reg2out] [get_bd_pins accum_sync/Din]
connect_bd_net -net In1_1 [get_bd_pins In1] [get_bd_pins wide_bram/In1] [get_bd_pins i_adc_splitter/Din]
connect_bd_net [get_bd_pins blk_mem_gen_0/doutb] [get_bd_pins even_bin_slice/Din] [get_bd_pins odd_bin_slice/Din]
connect_bd_net -net Q_concat_dout [get_bd_pins fft_concat/dout] [get_bd_pins wide_bram/In2]
connect_bd_net [get_bd_pins accum_concat/dout] [get_bd_pins c_shift_ram_0/D]
connect_bd_net -net axi_gpio_0_gpio2_io_o [get_bd_pins axi_wide_ctrl/gpio2_io_o] [get_bd_pins xlslice_1/Din] [get_bd_pins xlslice_2/Din]
connect_bd_net -net axi_gpio_0_gpio_io_o [get_bd_pins axi_wide_ctrl/gpio_io_o] [get_bd_pins wide_bram/max_count_minus_one_step]
connect_bd_net [get_bd_pins blast_module_v6_cord_0/accum_snap_i0] [get_bd_pins accum_concat/In0]
connect_bd_net [get_bd_pins blast_module_v6_cord_0/accum_snap_i1] [get_bd_pins accum_concat/In2]
connect_bd_net [get_bd_pins blast_module_v6_cord_0/accum_snap_q0] [get_bd_pins accum_concat/In1]
connect_bd_net [get_bd_pins blast_module_v6_cord_0/accum_snap_q1] [get_bd_pins accum_concat/In3]
connect_bd_net [get_bd_pins blast_module_v6_cord_0/accum_snap_sync] [get_bd_pins wide_bram/d4] [get_bd_pins accum_snap_sync]
connect_bd_net [get_bd_pins blast_module_v6_cord_0/ddc_snap_i0q0] [get_bd_pins ddc_concat/In0]
connect_bd_net [get_bd_pins blast_module_v6_cord_0/ddc_snap_i1q1] [get_bd_pins ddc_concat/In1]
connect_bd_net [get_bd_pins blast_module_v6_cord_0/ddc_snap_sync] [get_bd_pins wide_bram/d2]
connect_bd_net [get_bd_pins blast_module_v6_cord_0/fft_snap_i0q0] [get_bd_pins fft_concat/In0]
connect_bd_net [get_bd_pins blast_module_v6_cord_0/fft_snap_i1q1] [get_bd_pins fft_concat/In1]
connect_bd_net [get_bd_pins blast_module_v6_cord_0/fft_snap_sync] [get_bd_pins wide_bram/d1]
connect_bd_net [get_bd_pins c_counter_binary_0/Q] [get_bd_pins blk_mem_gen_0/addrb]
connect_bd_net [get_bd_pins c_shift_ram_0/Q] [get_bd_pins wide_bram/d3] [get_bd_pins Q]
connect_bd_net -net clk_wiz_0_clk_out1 [get_bd_pins s00_axi_aclk] \
  [get_bd_pins dsp_regs_0/s00_axi_aclk] [get_bd_pins wide_bram/s_axi_aclk] [get_bd_pins wide_bram/CLK] \
  [get_bd_pins c_counter_binary_0/CLK] [get_bd_pins blk_mem_gen_0/clkb] [get_bd_pins c_shift_ram_0/CLK] \
  [get_bd_pins axi_dphi_bram/s_axi_aclk] [get_bd_pins blast_module_v6_cord_0/clk]
connect_bd_net -net delay_2_q [get_bd_pins In0] [get_bd_pins wide_bram/In0] [get_bd_pins q_adc_splitter/Din]
connect_bd_net -net dina_1 [get_bd_pins ddc_concat/dout] [get_bd_pins wide_bram/In3]
connect_bd_net [get_bd_pins dsp_regs_0/reg0out] [get_bd_pins fft_shift_slice/Din] [get_bd_pins load_bins_slice/Din]
connect_bd_net [get_bd_pins dsp_regs_0/reg1out] [get_bd_pins bin_num_slice/Din]
connect_bd_net [get_bd_pins dsp_regs_0/reg3out] [get_bd_pins dds_shift_slice/Din]
connect_bd_net [get_bd_pins even_bin_slice/Dout] [get_bd_pins blast_module_v6_cord_0/dphi_even]
connect_bd_net -net gpio1_Dout [get_bd_pins fft_shift_slice/Dout] [get_bd_pins blast_module_v6_cord_0/fft_shift]
connect_bd_net -net gpio1_Dout1 [get_bd_pins load_bins_slice/Dout] [get_bd_pins blast_module_v6_cord_0/load_bins]
connect_bd_net -net i0_Dout [get_bd_pins dds_shift_slice/Dout] [get_bd_pins blast_module_v6_cord_0/dds_shift]
connect_bd_net -net i2_Dout [get_bd_pins bin_num_slice/Dout] [get_bd_pins blast_module_v6_cord_0/bin_num]
connect_bd_net -net i_splitter_i0 [get_bd_pins i_adc_splitter/i0] [get_bd_pins blast_module_v6_cord_0/adc_i0]
connect_bd_net -net i_splitter_i1 [get_bd_pins i_adc_splitter/i1] [get_bd_pins blast_module_v6_cord_0/adc_i1]
connect_bd_net -net module_config_splitter_Dout [get_bd_pins accum_sync/sync_in] \
  [get_bd_pins c_counter_binary_0/CE] [get_bd_pins blk_mem_gen_0/enb] [get_bd_pins blast_module_v6_cord_0/start_dac]
connect_bd_net -net module_config_splitter_accum_len [get_bd_pins accum_sync/accum_len] [get_bd_pins blast_module_v6_cord_0/accum_len]
connect_bd_net -net module_config_splitter_i1 [get_bd_pins accum_sync/accum_rst] [get_bd_pins blast_module_v6_cord_0/accum_reset]
connect_bd_net [get_bd_pins odd_bin_slice/Dout] [get_bd_pins blast_module_v6_cord_0/dphi_odd]
connect_bd_net -net q_splitter_i0 [get_bd_pins q_adc_splitter/i0] [get_bd_pins blast_module_v6_cord_0/adc_q0]
connect_bd_net -net q_splitter_i1 [get_bd_pins q_adc_splitter/i1] [get_bd_pins blast_module_v6_cord_0/adc_q1]
connect_bd_net -net s_axi_aresetn1_1 [get_bd_pins s_axi_aresetn1] \
  [get_bd_pins wide_bram/s_axi_aresetn] [get_bd_pins dsp_regs_0/s00_axi_aresetn] [get_bd_pins axi_dphi_bram/s_axi_aresetn]
connect_bd_net [get_bd_pins s_axi_aresetn] [get_bd_pins axi_wide_ctrl/s_axi_aresetn]
connect_bd_net [get_bd_pins xlconstant_5/dout] [get_bd_pins blk_mem_gen_0/web]
connect_bd_net [get_bd_pins xlconstant_6/dout] [get_bd_pins blk_mem_gen_0/rstb]
connect_bd_net [get_bd_pins xlconstant_7/dout] [get_bd_pins blk_mem_gen_0/dinb]
connect_bd_net [get_bd_pins xlslice_1/Dout] [get_bd_pins wide_bram/rising_edge_start]
connect_bd_net [get_bd_pins xlslice_2/Dout] [get_bd_pins wide_bram/sel]
connect_bd_net -net zynq_ultra_ps_e_0_pl_clk0 [get_bd_pins s_axi_aclk] [get_bd_pins axi_wide_ctrl/s_axi_aclk]
